# Altium schematic sheet SoC_FPGA_128-131_GTY.SchDoc: RFSoC AMC
size 420 x 297 mm; CompanyName: WUT; DrawnBy: T. Przywozki; Organization: WUT ISE; Address1: Warsaw University of Technology; Address2: Nowowiejska 15/19 00-665 Warsaw; Address3: Tomasz.Przywozki@pw.edu.pl; DocumentNumber: 6; Revision: 1; SheetNumber: 6; SheetTotal: 45; Project: RFSoC AMC; ModifiedBy: T. Przywozki; CreateDate: -; CheckedDate: -; DivGrp: ISE; Designer: T. Przywozki; ModifiedDate: -; ProjectName: ADC/DAC MEZZANINE
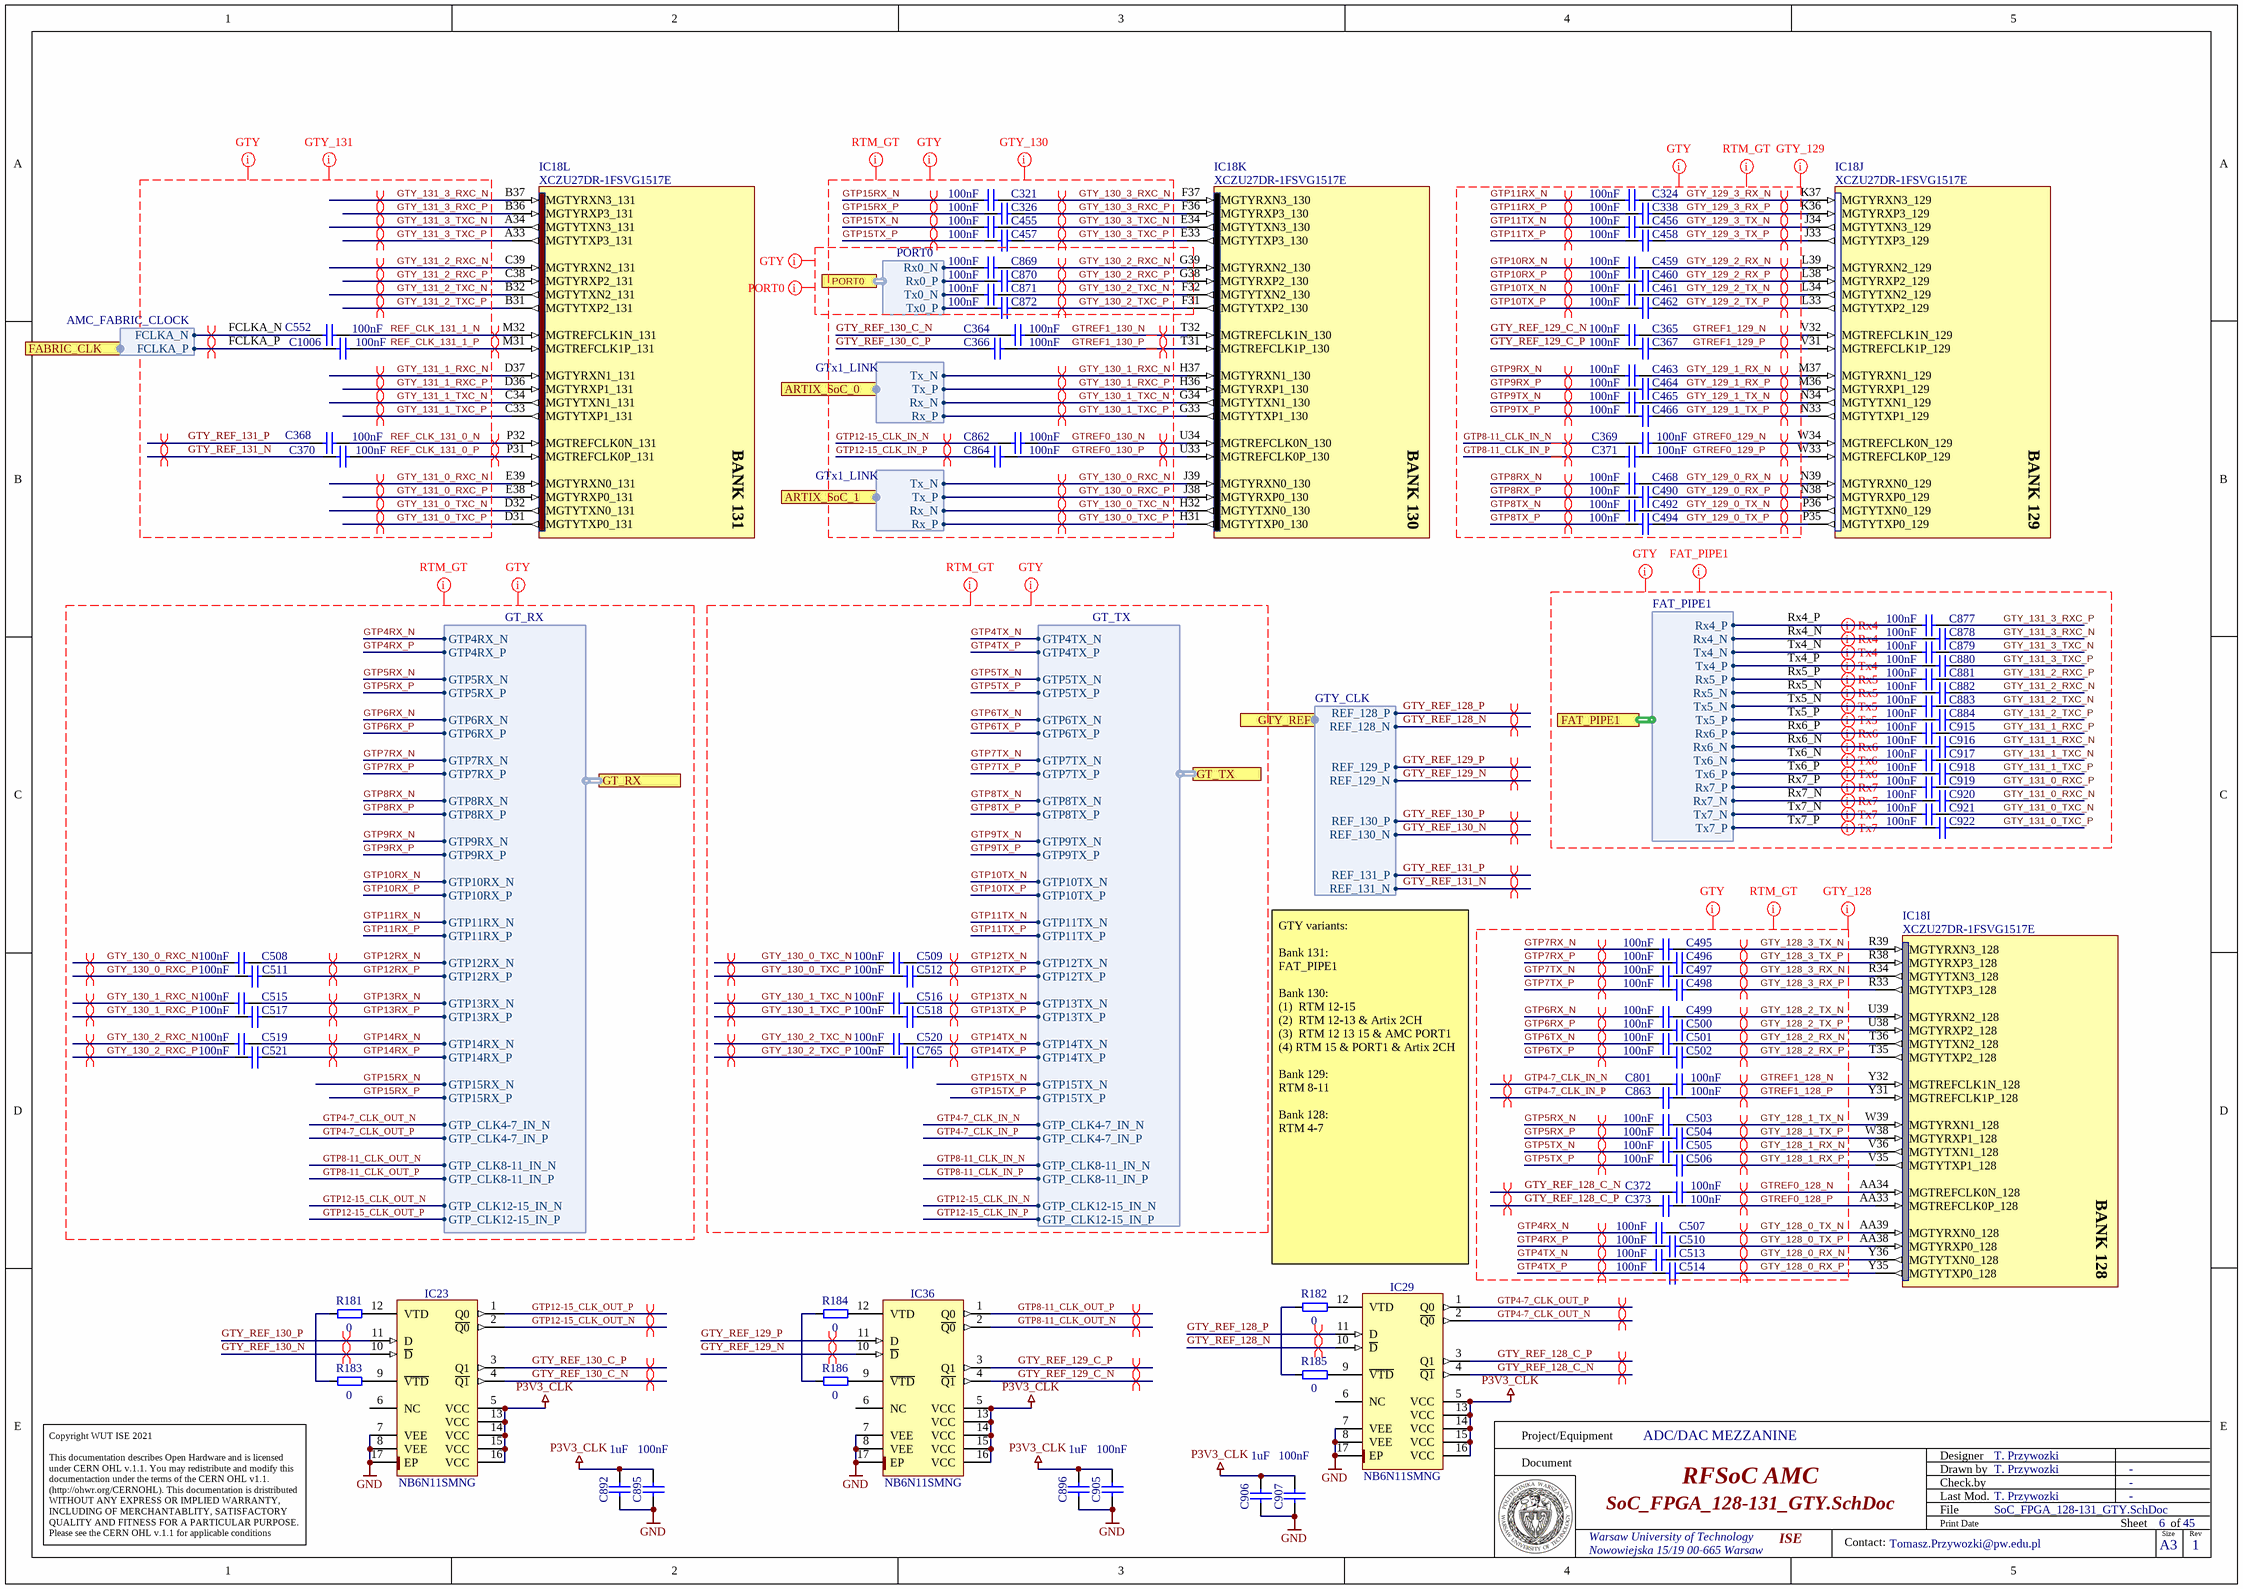
[diagram p0: SoC_FPGA_128-131_GTY.SchDoc]

## Parts
C321  100nF  [CAPC0603X33N]
C324  100nF  [CAPC0603X33N]
C326  100nF  [CAPC0603X33N]
C338  100nF  [CAPC0603X33N]
C364  100nF  [CAPC0603X33N]
C365  100nF  [CAPC0603X33N]
C366  100nF  [CAPC0603X33N]
C367  100nF  [CAPC0603X33N]
C368  100nF  [CAPC0603X33N]
C369  100nF  [CAPC0603X33N]
C370  100nF  [CAPC0603X33N]
C371  100nF  [CAPC0603X33N]
C372  100nF  [CAPC0603X33N]
C373  100nF  [CAPC0603X33N]
C455  100nF  [CAPC0603X33N]
C456  100nF  [CAPC0603X33N]
C457  100nF  [CAPC0603X33N]
C458  100nF  [CAPC0603X33N]
C459  100nF  [CAPC0603X33N]
C460  100nF  [CAPC0603X33N]
C461  100nF  [CAPC0603X33N]
C462  100nF  [CAPC0603X33N]
C463  100nF  [CAPC0603X33N]
C464  100nF  [CAPC0603X33N]
C465  100nF  [CAPC0603X33N]
C466  100nF  [CAPC0603X33N]
C468  100nF  [CAPC0603X33N]
C490  100nF  [CAPC0603X33N]
C492  100nF  [CAPC0603X33N]
C494  100nF  [CAPC0603X33N]
C495  100nF  [CAPC0603X33N]
C496  100nF  [CAPC0603X33N]
C497  100nF  [CAPC0603X33N]
C498  100nF  [CAPC0603X33N]
C499  100nF  [CAPC0603X33N]
C500  100nF  [CAPC0603X33N]
C501  100nF  [CAPC0603X33N]
C502  100nF  [CAPC0603X33N]
C503  100nF  [CAPC0603X33N]
C504  100nF  [CAPC0603X33N]
C505  100nF  [CAPC0603X33N]
C506  100nF  [CAPC0603X33N]
C507  100nF  [CAPC0603X33N]
C508  100nF  [CAPC0603X33N]
C509  100nF  [CAPC0603X33N]
C510  100nF  [CAPC0603X33N]
C511  100nF  [CAPC0603X33N]
C512  100nF  [CAPC0603X33N]
C513  100nF  [CAPC0603X33N]
C514  100nF  [CAPC0603X33N]
C515  100nF  [CAPC0603X33N]
C516  100nF  [CAPC0603X33N]
C517  100nF  [CAPC0603X33N]
C518  100nF  [CAPC0603X33N]
C519  100nF  [CAPC0603X33N]
C520  100nF  [CAPC0603X33N]
C521  100nF  [CAPC0603X33N]
C552  100nF  [CAPC0603X33N]
C765  100nF  [CAPC0603X33N]
C801  100nF  [CAPC0603X33N]
C862  100nF  [CAPC0603X33N]
C863  100nF  [CAPC0603X33N]
C864  100nF  [CAPC0603X33N]
C869  100nF  [CAPC0603X33N]
C870  100nF  [CAPC0603X33N]
C871  100nF  [CAPC0603X33N]
C872  100nF  [CAPC0603X33N]
C877  100nF  [CAPC0603X33N]
C878  100nF  [CAPC0603X33N]
C879  100nF  [CAPC0603X33N]
C880  100nF  [CAPC0603X33N]
C881  100nF  [CAPC0603X33N]
C882  100nF  [CAPC0603X33N]
C883  100nF  [CAPC0603X33N]
C884  100nF  [CAPC0603X33N]
C892  1uF  [CAPC1005X55N]
C895  100nF  [CAPC0603X33N]
C896  1uF  [CAPC1005X55N]
C905  100nF  [CAPC0603X33N]
C906  1uF  [CAPC1005X55N]
C907  100nF  [CAPC0603X33N]
C915  100nF  [CAPC0603X33N]
C916  100nF  [CAPC0603X33N]
C917  100nF  [CAPC0603X33N]
C918  100nF  [CAPC0603X33N]
C919  100nF  [CAPC0603X33N]
C920  100nF  [CAPC0603X33N]
C921  100nF  [CAPC0603X33N]
C922  100nF  [CAPC0603X33N]
C1006  100nF  [CAPC0603X33N]
IC18  XCZU27DR-1FSVG1517E  [XILINX_FSVG1517 (XCZU27DR)]  (parts I,J,K,L of 31)
IC23  NB6N11SMNG  [QFN50P300X300X100-17N-S185]
IC29  NB6N11SMNG  [QFN50P300X300X100-17N-S185]
IC36  NB6N11SMNG  [QFN50P300X300X100-17N-S185]
R181  0  [RESC1005X40N]
R182  0  [RESC1005X40N]
R183  0  [RESC1005X40N]
R184  0  [RESC1005X40N]
R185  0  [RESC1005X40N]
R186  0  [RESC1005X40N]

## Ports
ARTIX_SoC_0 (harness GTx1_LINK), ARTIX_SoC_1 (harness GTx1_LINK), FABRIC_CLK (harness AMC_FABRIC_CLOCK), FAT_PIPE1 (harness FAT_PIPE1), GT_RX (harness GT_RX), GT_TX (harness GT_TX), GTY_REF (harness GTY_CLK), PORT0 (harness PORT0)

## Harnesses
GT_RX: GTP5RX_N, GTP5RX_P, GTP6RX_N, GTP6RX_P, GTP7RX_N, GTP7RX_P, GTP8RX_N, GTP8RX_P, GTP9RX_N, GTP9RX_P, GTP10RX_N, GTP10RX_P, GTP11RX_N, GTP11RX_P, GTP12RX_N, GTP12RX_P, GTP13RX_N, GTP13RX_P, GTP14RX_N, GTP14RX_P, GTP15RX_N, GTP15RX_P, GTP4RX_N, GTP4RX_P, GTP_CLK4-7_IN_N, GTP_CLK8-11_IN_N, GTP_CLK4-7_IN_P, GTP_CLK8-11_IN_P, GTP_CLK12-15_IN_N, GTP_CLK12-15_IN_P
GT_TX: GTP5TX_N, GTP5TX_P, GTP6TX_N, GTP6TX_P, GTP7TX_N, GTP7TX_P, GTP8TX_N, GTP8TX_P, GTP9TX_N, GTP9TX_P, GTP10TX_N, GTP10TX_P, GTP11TX_N, GTP11TX_P, GTP12TX_N, GTP12TX_P, GTP13TX_N, GTP13TX_P, GTP14TX_N, GTP14TX_P, GTP15TX_N, GTP15TX_P, GTP4TX_N, GTP4TX_P, GTP_CLK4-7_IN_N, GTP_CLK8-11_IN_N, GTP_CLK4-7_IN_P, GTP_CLK8-11_IN_P, GTP_CLK12-15_IN_N, GTP_CLK12-15_IN_P
FAT_PIPE1: Rx4_P, Rx4_N, Tx4_N, Tx4_P, Rx5_P, Rx5_N, Tx5_N, Tx5_P, Rx6_P, Rx6_N, Tx6_N, Tx6_P, Rx7_P, Rx7_N, Tx7_N, Tx7_P
GTx1_LINK: Rx_P, Rx_N, Tx_P, Tx_N
PORT0: Rx0_P, Rx0_N, Tx0_N, Tx0_P
AMC_FABRIC_CLOCK: FCLKA_N, FCLKA_P
GTY_CLK: REF_128_P, REF_128_N, REF_129_P, REF_129_N, REF_130_P, REF_130_N, REF_131_P, REF_131_N

## Nets
GND: C892.2 C895.1 C896.2 C905.1 C906.2 C907.1 IC23.7(VEE) IC23.8(VEE) IC23.17(EP) IC29.7(VEE) IC29.8(VEE) IC29.17(EP) IC36.7(VEE) IC36.8(VEE) IC36.17(EP)
P3V3_CLK: C892.1 C895.2 C896.1 C905.2 C906.1 C907.2 IC23.5(VCC) IC23.13(VCC) IC23.14(VCC) IC23.15(VCC) IC23.16(VCC) IC29.5(VCC) IC29.13(VCC) IC29.14(VCC) IC29.15(VCC) IC29.16(VCC) IC36.5(VCC) IC36.13(VCC) IC36.14(VCC) IC36.15(VCC) IC36.16(VCC)
FCLKA_N: C552.1 ; port FABRIC_CLK.FCLKA_N
FCLKA_P: C1006.1 ; port FABRIC_CLK.FCLKA_P
GTP4-7_CLK_IN_N: C801.2 ; port GT_TX.GTP_CLK4-7_IN_N
GTP4-7_CLK_IN_P: C863.2 ; port GT_TX.GTP_CLK4-7_IN_P
GTP4-7_CLK_OUT_N: IC29.2(~{Q0}) ; port GT_RX.GTP_CLK4-7_IN_N
GTP4-7_CLK_OUT_P: IC29.1(Q0) ; port GT_RX.GTP_CLK4-7_IN_P
GTP4RX_N: C507.2 ; port GT_RX.GTP4RX_N
GTP4RX_P: C510.2 ; port GT_RX.GTP4RX_P
GTP4TX_N: C513.2 ; port GT_TX.GTP4TX_N
GTP4TX_P: C514.2 ; port GT_TX.GTP4TX_P
GTP5RX_N: C503.2 ; port GT_RX.GTP5RX_N
GTP5RX_P: C504.2 ; port GT_RX.GTP5RX_P
GTP5TX_N: C505.2 ; port GT_TX.GTP5TX_N
GTP5TX_P: C506.2 ; port GT_TX.GTP5TX_P
GTP6RX_N: C499.2 ; port GT_RX.GTP6RX_N
GTP6RX_P: C500.2 ; port GT_RX.GTP6RX_P
GTP6TX_N: C501.2 ; port GT_TX.GTP6TX_N
GTP6TX_P: C502.2 ; port GT_TX.GTP6TX_P
GTP7RX_N: C495.2 ; port GT_RX.GTP7RX_N
GTP7RX_P: C496.2 ; port GT_RX.GTP7RX_P
GTP7TX_N: C497.2 ; port GT_TX.GTP7TX_N
GTP7TX_P: C498.2 ; port GT_TX.GTP7TX_P
GTP8-11_CLK_IN_N: C369.2 ; port GT_TX.GTP_CLK8-11_IN_N
GTP8-11_CLK_IN_P: C371.2 ; port GT_TX.GTP_CLK8-11_IN_P
GTP8-11_CLK_OUT_N: IC36.2(~{Q0}) ; port GT_RX.GTP_CLK8-11_IN_N
GTP8-11_CLK_OUT_P: IC36.1(Q0) ; port GT_RX.GTP_CLK8-11_IN_P
GTP8RX_N: C468.2 ; port GT_RX.GTP8RX_N
GTP8RX_P: C490.2 ; port GT_RX.GTP8RX_P
GTP8TX_N: C492.2 ; port GT_TX.GTP8TX_N
GTP8TX_P: C494.2 ; port GT_TX.GTP8TX_P
GTP9RX_N: C463.2 ; port GT_RX.GTP9RX_N
GTP9RX_P: C464.2 ; port GT_RX.GTP9RX_P
GTP9TX_N: C465.2 ; port GT_TX.GTP9TX_N
GTP9TX_P: C466.2 ; port GT_TX.GTP9TX_P
GTP10RX_N: C459.2 ; port GT_RX.GTP10RX_N
GTP10RX_P: C460.2 ; port GT_RX.GTP10RX_P
GTP10TX_N: C461.2 ; port GT_TX.GTP10TX_N
GTP10TX_P: C462.2 ; port GT_TX.GTP10TX_P
GTP11RX_N: C324.2 ; port GT_RX.GTP11RX_N
GTP11RX_P: C338.2 ; port GT_RX.GTP11RX_P
GTP11TX_N: C456.2 ; port GT_TX.GTP11TX_N
GTP11TX_P: C458.2 ; port GT_TX.GTP11TX_P
GTP12-15_CLK_IN_N: C862.2 ; port GT_TX.GTP_CLK12-15_IN_N
GTP12-15_CLK_IN_P: C864.2 ; port GT_TX.GTP_CLK12-15_IN_P
GTP12-15_CLK_OUT_N: IC23.2(~{Q0}) ; port GT_RX.GTP_CLK12-15_IN_N
GTP12-15_CLK_OUT_P: IC23.1(Q0) ; port GT_RX.GTP_CLK12-15_IN_P
GTP12RX_N: C508.1 ; port GT_RX.GTP12RX_N
GTP12RX_P: C511.1 ; port GT_RX.GTP12RX_P
GTP12TX_N: C509.1 ; port GT_TX.GTP12TX_N
GTP12TX_P: C512.1 ; port GT_TX.GTP12TX_P
GTP13RX_N: C515.1 ; port GT_RX.GTP13RX_N
GTP13RX_P: C517.1 ; port GT_RX.GTP13RX_P
GTP13TX_N: C516.1 ; port GT_TX.GTP13TX_N
GTP13TX_P: C518.1 ; port GT_TX.GTP13TX_P
GTP14RX_N: C519.1 ; port GT_RX.GTP14RX_N
GTP14RX_P: C521.1 ; port GT_RX.GTP14RX_P
GTP14TX_N: C520.1 ; port GT_TX.GTP14TX_N
GTP14TX_P: C765.1 ; port GT_TX.GTP14TX_P
GTP15RX_N: C321.2 ; port GT_RX.GTP15RX_N
GTP15RX_P: C326.2 ; port GT_RX.GTP15RX_P
GTP15TX_N: C455.2 ; port GT_TX.GTP15TX_N
GTP15TX_P: C457.2 ; port GT_TX.GTP15TX_P
GTREF0_128_N: C372.1 IC18.AA34(MGTREFCLK0N_128)
GTREF0_128_P: C373.1 IC18.AA33(MGTREFCLK0P_128)
GTREF0_129_N: C369.1 IC18.W34(MGTREFCLK0N_129)
GTREF0_129_P: C371.1 IC18.W33(MGTREFCLK0P_129)
GTREF0_130_N: C862.1 IC18.U34(MGTREFCLK0N_130)
GTREF0_130_P: C864.1 IC18.U33(MGTREFCLK0P_130)
GTREF1_128_N: C801.1 IC18.Y32(MGTREFCLK1N_128)
GTREF1_128_P: C863.1 IC18.Y31(MGTREFCLK1P_128)
GTREF1_129_N: C365.1 IC18.V32(MGTREFCLK1N_129)
GTREF1_129_P: C367.1 IC18.V31(MGTREFCLK1P_129)
GTREF1_130_N: C364.1 IC18.T32(MGTREFCLK1N_130)
GTREF1_130_P: C366.1 IC18.T31(MGTREFCLK1P_130)
GTY_128_0_RX_N: C513.1 IC18.Y36(MGTYTXN0_128)
GTY_128_0_RX_P: C514.1 IC18.Y35(MGTYTXP0_128)
GTY_128_0_TX_N: C507.1 IC18.AA39(MGTYRXN0_128)
GTY_128_0_TX_P: C510.1 IC18.AA38(MGTYRXP0_128)
GTY_128_1_RX_N: C505.1 IC18.V36(MGTYTXN1_128)
GTY_128_1_RX_P: C506.1 IC18.V35(MGTYTXP1_128)
GTY_128_1_TX_N: C503.1 IC18.W39(MGTYRXN1_128)
GTY_128_1_TX_P: C504.1 IC18.W38(MGTYRXP1_128)
GTY_128_2_RX_N: C501.1 IC18.T36(MGTYTXN2_128)
GTY_128_2_RX_P: C502.1 IC18.T35(MGTYTXP2_128)
GTY_128_2_TX_N: C499.1 IC18.U39(MGTYRXN2_128)
GTY_128_2_TX_P: C500.1 IC18.U38(MGTYRXP2_128)
GTY_128_3_RX_N: C497.1 IC18.R34(MGTYTXN3_128)
GTY_128_3_RX_P: C498.1 IC18.R33(MGTYTXP3_128)
GTY_128_3_TX_N: C495.1 IC18.R39(MGTYRXN3_128)
GTY_128_3_TX_P: C496.1 IC18.R38(MGTYRXP3_128)
GTY_129_0_RX_N: C468.1 IC18.N39(MGTYRXN0_129)
GTY_129_0_RX_P: C490.1 IC18.N38(MGTYRXP0_129)
GTY_129_0_TX_N: C492.1 IC18.P36(MGTYTXN0_129)
GTY_129_0_TX_P: C494.1 IC18.P35(MGTYTXP0_129)
GTY_129_1_RX_N: C463.1 IC18.M37(MGTYRXN1_129)
GTY_129_1_RX_P: C464.1 IC18.M36(MGTYRXP1_129)
GTY_129_1_TX_N: C465.1 IC18.N34(MGTYTXN1_129)
GTY_129_1_TX_P: C466.1 IC18.N33(MGTYTXP1_129)
GTY_129_2_RX_N: C459.1 IC18.L39(MGTYRXN2_129)
GTY_129_2_RX_P: C460.1 IC18.L38(MGTYRXP2_129)
GTY_129_2_TX_N: C461.1 IC18.L34(MGTYTXN2_129)
GTY_129_2_TX_P: C462.1 IC18.L33(MGTYTXP2_129)
GTY_129_3_RX_N: C324.1 IC18.K37(MGTYRXN3_129)
GTY_129_3_RX_P: C338.1 IC18.K36(MGTYRXP3_129)
GTY_129_3_TX_N: C456.1 IC18.J34(MGTYTXN3_129)
GTY_129_3_TX_P: C458.1 IC18.J33(MGTYTXP3_129)
GTY_130_0_RXC_N: C508.2 IC18.J39(MGTYRXN0_130) ; port ARTIX_SoC_1.Tx_N
GTY_130_0_RXC_P: C511.2 IC18.J38(MGTYRXP0_130) ; port ARTIX_SoC_1.Tx_P
GTY_130_0_TXC_N: C509.2 IC18.H32(MGTYTXN0_130) ; port ARTIX_SoC_1.Rx_N
GTY_130_0_TXC_P: C512.2 IC18.H31(MGTYTXP0_130) ; port ARTIX_SoC_1.Rx_P
GTY_130_1_RXC_N: C515.2 IC18.H37(MGTYRXN1_130) ; port ARTIX_SoC_0.Tx_N
GTY_130_1_RXC_P: C517.2 IC18.H36(MGTYRXP1_130) ; port ARTIX_SoC_0.Tx_P
GTY_130_1_TXC_N: C516.2 IC18.G34(MGTYTXN1_130) ; port ARTIX_SoC_0.Rx_N
GTY_130_1_TXC_P: C518.2 IC18.G33(MGTYTXP1_130) ; port ARTIX_SoC_0.Rx_P
GTY_130_2_RXC_N: C519.2 C869.1 IC18.G39(MGTYRXN2_130)
GTY_130_2_RXC_P: C521.2 C870.1 IC18.G38(MGTYRXP2_130)
GTY_130_2_TXC_N: C520.2 C871.1 IC18.F32(MGTYTXN2_130)
GTY_130_2_TXC_P: C765.2 C872.1 IC18.F31(MGTYTXP2_130)
GTY_130_3_RXC_N: C321.1 IC18.F37(MGTYRXN3_130)
GTY_130_3_RXC_P: C326.1 IC18.F36(MGTYRXP3_130)
GTY_130_3_TXC_N: C455.1 IC18.E34(MGTYTXN3_130)
GTY_130_3_TXC_P: C457.1 IC18.E33(MGTYTXP3_130)
GTY_131_0_RXC_N: C920.1 IC18.E39(MGTYRXN0_131)
GTY_131_0_RXC_P: C919.1 IC18.E38(MGTYRXP0_131)
GTY_131_0_TXC_N: C921.1 IC18.D32(MGTYTXN0_131)
GTY_131_0_TXC_P: C922.1 IC18.D31(MGTYTXP0_131)
GTY_131_1_RXC_N: C916.1 IC18.D37(MGTYRXN1_131)
GTY_131_1_RXC_P: C915.1 IC18.D36(MGTYRXP1_131)
GTY_131_1_TXC_N: C917.1 IC18.C34(MGTYTXN1_131)
GTY_131_1_TXC_P: C918.1 IC18.C33(MGTYTXP1_131)
GTY_131_2_RXC_N: C882.1 IC18.C39(MGTYRXN2_131)
GTY_131_2_RXC_P: C881.1 IC18.C38(MGTYRXP2_131)
GTY_131_2_TXC_N: C883.1 IC18.B32(MGTYTXN2_131)
GTY_131_2_TXC_P: C884.1 IC18.B31(MGTYTXP2_131)
GTY_131_3_RXC_N: C878.1 IC18.B37(MGTYRXN3_131)
GTY_131_3_RXC_P: C877.1 IC18.B36(MGTYRXP3_131)
GTY_131_3_TXC_N: C879.1 IC18.A34(MGTYTXN3_131)
GTY_131_3_TXC_P: C880.1 IC18.A33(MGTYTXP3_131)
GTY_REF_128_C_N: C372.2 IC29.4(~{Q1})
GTY_REF_128_C_P: C373.2 IC29.3(Q1)
GTY_REF_128_N: IC29.10(~{D}) ; port GTY_REF.REF_128_N
GTY_REF_128_P: IC29.11(D) ; port GTY_REF.REF_128_P
GTY_REF_129_C_N: C365.2 IC36.4(~{Q1})
GTY_REF_129_C_P: C367.2 IC36.3(Q1)
GTY_REF_129_N: IC36.10(~{D}) ; port GTY_REF.REF_129_N
GTY_REF_129_P: IC36.11(D) ; port GTY_REF.REF_129_P
GTY_REF_130_C_N: C364.2 IC23.4(~{Q1})
GTY_REF_130_C_P: C366.2 IC23.3(Q1)
GTY_REF_130_N: IC23.10(~{D}) ; port GTY_REF.REF_130_N
GTY_REF_130_P: IC23.11(D) ; port GTY_REF.REF_130_P
GTY_REF_131_N: C370.1 ; port GTY_REF.REF_131_N
GTY_REF_131_P: C368.1 ; port GTY_REF.REF_131_P
REF_CLK_131_0_N: C368.2 IC18.P32(MGTREFCLK0N_131)
REF_CLK_131_0_P: C370.2 IC18.P31(MGTREFCLK0P_131)
REF_CLK_131_1_N: C552.2 IC18.M32(MGTREFCLK1N_131)
REF_CLK_131_1_P: C1006.2 IC18.M31(MGTREFCLK1P_131)
Rx4_N: C878.2 ; port FAT_PIPE1.Rx4_N
Rx4_P: C877.2 ; port FAT_PIPE1.Rx4_P
Rx5_N: C882.2 ; port FAT_PIPE1.Rx5_N
Rx5_P: C881.2 ; port FAT_PIPE1.Rx5_P
Rx6_N: C916.2 ; port FAT_PIPE1.Rx6_N
Rx6_P: C915.2 ; port FAT_PIPE1.Rx6_P
Rx7_N: C920.2 ; port FAT_PIPE1.Rx7_N
Rx7_P: C919.2 ; port FAT_PIPE1.Rx7_P
Tx4_N: C879.2 ; port FAT_PIPE1.Tx4_N
Tx4_P: C880.2 ; port FAT_PIPE1.Tx4_P
Tx5_N: C883.2 ; port FAT_PIPE1.Tx5_N
Tx5_P: C884.2 ; port FAT_PIPE1.Tx5_P
Tx6_N: C917.2 ; port FAT_PIPE1.Tx6_N
Tx6_P: C918.2 ; port FAT_PIPE1.Tx6_P
Tx7_N: C921.2 ; port FAT_PIPE1.Tx7_N
Tx7_P: C922.2 ; port FAT_PIPE1.Tx7_P
NetC869_2: C869.2 ; port PORT0.Rx0_N
NetC870_2: C870.2 ; port PORT0.Rx0_P
NetC871_2: C871.2 ; port PORT0.Tx0_N
NetC872_2: C872.2 ; port PORT0.Tx0_P
NetIC23_9: IC23.9(~{VTD}) R183.2
NetIC23_12: IC23.12(VTD) R181.2
NetIC29_9: IC29.9(~{VTD}) R185.2
NetIC29_12: IC29.12(VTD) R182.2
NetIC36_9: IC36.9(~{VTD}) R186.2
NetIC36_12: IC36.12(VTD) R184.2
NetR181_1: R181.1 R183.1
NetR182_1: R182.1 R185.1
NetR184_1: R184.1 R186.1

Not connected (* = marked no-connect by the designer): IC23 6(NC); IC29 6(NC); IC36 6(NC)

## Layout directives
differential pair; differential pair class 100Ohm: GTP4-7_CLK_OUT_N, GTP4-7_CLK_OUT_P, GTP8-11_CLK_OUT_N, GTP8-11_CLK_OUT_P, GTP12-15_CLK_IN_N, GTP12-15_CLK_IN_P, GTP12-15_CLK_OUT_N, GTP12-15_CLK_OUT_P, GTP12RX_N, GTP12RX_P, GTP12TX_N, GTP12TX_P, GTP13RX_N, GTP13RX_P, GTP13TX_N, GTP13TX_P, GTP14RX_N, GTP14RX_P, GTP14TX_N, GTP14TX_P, GTP15RX_N, GTP15RX_P, GTP15TX_N, GTP15TX_P, GTREF0_129_N, GTREF0_129_P, GTREF1_129_N, GTREF1_129_P, GTY_129_0_RX_N, GTY_129_0_RX_P, GTY_129_0_TX_N, GTY_129_0_TX_P, GTY_129_1_RX_N, GTY_129_1_RX_P, GTY_129_1_TX_N, GTY_129_1_TX_P, GTY_129_2_RX_N, GTY_129_2_RX_P, GTY_129_2_TX_N, GTY_129_2_TX_P, GTY_129_3_RX_N, GTY_129_3_RX_P, GTY_129_3_TX_N, GTY_129_3_TX_P, GTY_130_0_RXC_N, GTY_130_0_RXC_P, GTY_130_0_TXC_N, GTY_130_0_TXC_P, GTY_130_1_RXC_N, GTY_130_1_RXC_P, GTY_130_1_TXC_N, GTY_130_1_TXC_P, GTY_130_2_RXC_N, GTY_130_2_RXC_P, GTY_130_2_TXC_N, GTY_130_2_TXC_P, GTY_130_3_RXC_N, GTY_130_3_RXC_P, GTY_130_3_TXC_N, GTY_130_3_TXC_P, GTY_131_0_RXC_N, GTY_131_0_RXC_P, GTY_131_0_TXC_N, GTY_131_0_TXC_P, GTY_131_1_RXC_N, GTY_131_1_RXC_P, GTY_131_1_TXC_N, GTY_131_1_TXC_P, GTY_131_2_RXC_N, GTY_131_2_RXC_P, GTY_131_2_TXC_N, GTY_131_2_TXC_P, GTY_131_3_RXC_P, GTY_131_3_TXC_N, GTY_131_3_TXC_P, GTY_REF_128_C_N, GTY_REF_128_C_P, GTY_REF_128_N, GTY_REF_128_P, GTY_REF_129_C_N, GTY_REF_129_C_P, GTY_REF_129_N, GTY_REF_129_P, GTY_REF_130_C_N, GTY_REF_130_C_P, GTY_REF_130_N, GTY_REF_130_P, GTY_REF_131_N, GTY_REF_131_P
differential pair: FCLKA_N, FCLKA_P, GTP4-7_CLK_IN_N, GTP4-7_CLK_IN_P, GTP4RX_N, GTP4RX_P, GTP4TX_N, GTP4TX_P, GTP5RX_N, GTP5RX_P, GTP5TX_N, GTP5TX_P, GTP6RX_N, GTP6RX_P, GTP6TX_N, GTP6TX_P, GTP7RX_N, GTP7RX_P, GTP7TX_N, GTP7TX_P, GTP8-11_CLK_IN_N, GTP8-11_CLK_IN_P, GTP8RX_N, GTP8RX_P, GTP8TX_N, GTP8TX_P, GTP9RX_N, GTP9RX_P, GTP9TX_N, GTP9TX_P, GTP10RX_N, GTP10RX_P, GTP10TX_N, GTP10TX_P, GTP11RX_N, GTP11RX_P, GTP11TX_N, GTP11TX_P, GTREF0_128_N, GTREF0_128_P, GTREF0_130_N, GTREF0_130_P, GTREF1_128_N, GTREF1_128_P, GTREF1_130_N, GTREF1_130_P, GTY_128_0_RX_N, GTY_128_0_RX_P, GTY_128_0_TX_N, GTY_128_0_TX_P, GTY_128_1_RX_N, GTY_128_1_RX_P, GTY_128_1_TX_N, GTY_128_1_TX_P, GTY_128_2_RX_N, GTY_128_2_RX_P, GTY_128_2_TX_N, GTY_128_2_TX_P, GTY_128_3_RX_N, GTY_128_3_RX_P, GTY_128_3_TX_N, GTY_128_3_TX_P, GTY_REF_128_C_N, GTY_REF_128_C_P, GTY_REF_128_N, GTY_REF_128_P, GTY_REF_129_N, GTY_REF_129_P, GTY_REF_130_N, GTY_REF_130_P, GTY_REF_131_N, GTY_REF_131_P, REF_CLK_131_0_N, REF_CLK_131_0_P, REF_CLK_131_1_N, REF_CLK_131_1_P, Rx4_N, Rx4_P, Rx5_N, Rx5_P, Rx6_N, Rx6_P, Rx7_N, Rx7_P, Tx4_N, Tx4_P, Tx5_N, Tx5_P, Tx6_N, Tx6_P, Tx7_N, Tx7_P
differential pair; differential pair class GTY: GTY_131_3_RXC_N
net class FAT_PIPE1: GTY_131_0_RXC_N, GTY_131_0_RXC_P, GTY_131_0_TXC_N, GTY_131_0_TXC_P, GTY_131_1_RXC_N, GTY_131_1_RXC_P, GTY_131_1_TXC_N, GTY_131_1_TXC_P, GTY_131_2_RXC_N, GTY_131_2_RXC_P, GTY_131_2_TXC_N, GTY_131_2_TXC_P, GTY_131_3_RXC_N, GTY_131_3_RXC_P, GTY_131_3_TXC_N, GTY_131_3_TXC_P, Rx4_N, Rx4_P, Rx5_N, Rx5_P, Rx6_N, Rx6_P, Rx7_N, Rx7_P, Tx4_N, Tx4_P, Tx5_N, Tx5_P, Tx6_N, Tx6_P, Tx7_N, Tx7_P
net class PORT0: GTY_130_2_RXC_N, GTY_130_2_RXC_P, GTY_130_2_TXC_N, GTY_130_2_TXC_P
net class GTY: GTY_130_2_RXC_N, GTY_130_2_RXC_P, GTY_130_2_TXC_N, GTY_130_2_TXC_P
net class GTY; net class GT: FCLKA_N, FCLKA_P, GTP4-7_CLK_IN_N, GTP4-7_CLK_IN_P, GTP4-7_CLK_OUT_N, GTP4-7_CLK_OUT_P, GTP4RX_N, GTP4RX_P, GTP4TX_N, GTP4TX_P, GTP5RX_N, GTP5RX_P, GTP5TX_N, GTP5TX_P, GTP6RX_N, GTP6RX_P, GTP6TX_N, GTP6TX_P, GTP7RX_N, GTP7RX_P, GTP7TX_N, GTP7TX_P, GTP8-11_CLK_IN_N, GTP8-11_CLK_IN_P, GTP8-11_CLK_OUT_N, GTP8-11_CLK_OUT_P, GTP8RX_N, GTP8RX_P, GTP8TX_N, GTP8TX_P, GTP9RX_N, GTP9RX_P, GTP9TX_N, GTP9TX_P, GTP10RX_N, GTP10RX_P, GTP10TX_N, GTP10TX_P, GTP11RX_N, GTP11RX_P, GTP11TX_N, GTP11TX_P, GTP12-15_CLK_IN_N, GTP12-15_CLK_IN_P, GTP12-15_CLK_OUT_N, GTP12-15_CLK_OUT_P, GTP12RX_N, GTP12RX_P, GTP12TX_N, GTP12TX_P, GTP13RX_N, GTP13RX_P, GTP13TX_N, GTP13TX_P, GTP14RX_N, GTP14RX_P, GTP14TX_N, GTP14TX_P, GTP15RX_N, GTP15RX_P, GTP15TX_N, GTP15TX_P, GTREF0_128_N, GTREF0_128_P, GTREF0_129_N, GTREF0_129_P, GTREF0_130_N, GTREF0_130_P, GTREF1_128_N, GTREF1_128_P, GTREF1_129_N, GTREF1_129_P, GTREF1_130_N, GTREF1_130_P, GTY_128_0_RX_N, GTY_128_0_RX_P, GTY_128_0_TX_N, GTY_128_0_TX_P, GTY_128_1_RX_N, GTY_128_1_RX_P, GTY_128_1_TX_N, GTY_128_1_TX_P, GTY_128_2_RX_N, GTY_128_2_RX_P, GTY_128_2_TX_N, GTY_128_2_TX_P, GTY_128_3_RX_N, GTY_128_3_RX_P, GTY_128_3_TX_N, GTY_128_3_TX_P, GTY_129_0_RX_N, GTY_129_0_RX_P, GTY_129_0_TX_N, GTY_129_0_TX_P, GTY_129_1_RX_N, GTY_129_1_RX_P, GTY_129_1_TX_N, GTY_129_1_TX_P, GTY_129_2_RX_N, GTY_129_2_RX_P, GTY_129_2_TX_N, GTY_129_2_TX_P, GTY_129_3_RX_N, GTY_129_3_RX_P, GTY_129_3_TX_N, GTY_129_3_TX_P, GTY_130_0_RXC_N, GTY_130_0_RXC_P, GTY_130_0_TXC_N, GTY_130_0_TXC_P, GTY_130_1_RXC_N, GTY_130_1_RXC_P, GTY_130_1_TXC_N, GTY_130_1_TXC_P, GTY_130_2_RXC_N, GTY_130_2_RXC_P, GTY_130_2_TXC_N, GTY_130_2_TXC_P, GTY_130_3_RXC_N, GTY_130_3_RXC_P, GTY_130_3_TXC_N, GTY_130_3_TXC_P, GTY_131_0_RXC_N, GTY_131_0_RXC_P, GTY_131_0_TXC_N, GTY_131_0_TXC_P, GTY_131_1_RXC_N, GTY_131_1_RXC_P, GTY_131_1_TXC_N, GTY_131_1_TXC_P, GTY_131_2_RXC_N, GTY_131_2_RXC_P, GTY_131_2_TXC_N, GTY_131_2_TXC_P, GTY_131_3_RXC_N, GTY_131_3_RXC_P, GTY_131_3_TXC_N, GTY_131_3_TXC_P, GTY_REF_128_C_N, GTY_REF_128_C_P, GTY_REF_129_C_N, GTY_REF_129_C_P, GTY_REF_130_C_N, GTY_REF_130_C_P, GTY_REF_131_N, GTY_REF_131_P, REF_CLK_131_0_N, REF_CLK_131_0_P, REF_CLK_131_1_N, REF_CLK_131_1_P, Rx4_N, Rx4_P, Rx5_N, Rx5_P, Rx6_N, Rx6_P, Rx7_N, Rx7_P, Tx4_N, Tx4_P, Tx5_N, Tx5_P, Tx6_N, Tx6_P, Tx7_N, Tx7_P
net class RTM_GT: GTP4-7_CLK_IN_N, GTP4-7_CLK_IN_P, GTP4-7_CLK_OUT_N, GTP4-7_CLK_OUT_P, GTP4RX_N, GTP4RX_P, GTP4TX_N, GTP4TX_P, GTP5RX_N, GTP5RX_P, GTP5TX_N, GTP5TX_P, GTP6RX_N, GTP6RX_P, GTP6TX_N, GTP6TX_P, GTP7RX_N, GTP7RX_P, GTP7TX_N, GTP7TX_P, GTP8-11_CLK_IN_N, GTP8-11_CLK_IN_P, GTP8-11_CLK_OUT_N, GTP8-11_CLK_OUT_P, GTP8RX_N, GTP8RX_P, GTP8TX_N, GTP8TX_P, GTP9RX_N, GTP9RX_P, GTP9TX_N, GTP9TX_P, GTP10RX_N, GTP10RX_P, GTP10TX_N, GTP10TX_P, GTP11RX_N, GTP11RX_P, GTP11TX_N, GTP11TX_P, GTP12-15_CLK_IN_N, GTP12-15_CLK_IN_P, GTP12-15_CLK_OUT_N, GTP12-15_CLK_OUT_P, GTP12RX_N, GTP12RX_P, GTP12TX_N, GTP12TX_P, GTP13RX_N, GTP13RX_P, GTP13TX_N, GTP13TX_P, GTP14RX_N, GTP14RX_P, GTP14TX_N, GTP14TX_P, GTP15RX_N, GTP15RX_P, GTP15TX_N, GTP15TX_P, GTREF0_128_N, GTREF0_128_P, GTREF0_129_N, GTREF0_129_P, GTREF0_130_N, GTREF0_130_P, GTREF1_128_N, GTREF1_128_P, GTREF1_129_N, GTREF1_129_P, GTREF1_130_N, GTREF1_130_P, GTY_128_0_RX_N, GTY_128_0_RX_P, GTY_128_0_TX_N, GTY_128_0_TX_P, GTY_128_1_RX_N, GTY_128_1_RX_P, GTY_128_1_TX_N, GTY_128_1_TX_P, GTY_128_2_RX_N, GTY_128_2_RX_P, GTY_128_2_TX_N, GTY_128_2_TX_P, GTY_128_3_RX_N, GTY_128_3_RX_P, GTY_128_3_TX_N, GTY_128_3_TX_P, GTY_129_0_RX_N, GTY_129_0_RX_P, GTY_129_0_TX_N, GTY_129_0_TX_P, GTY_129_1_RX_N, GTY_129_1_RX_P, GTY_129_1_TX_N, GTY_129_1_TX_P, GTY_129_2_RX_N, GTY_129_2_RX_P, GTY_129_2_TX_N, GTY_129_2_TX_P, GTY_129_3_RX_N, GTY_129_3_RX_P, GTY_129_3_TX_N, GTY_129_3_TX_P, GTY_130_0_RXC_N, GTY_130_0_RXC_P, GTY_130_0_TXC_N, GTY_130_0_TXC_P, GTY_130_1_RXC_N, GTY_130_1_RXC_P, GTY_130_1_TXC_N, GTY_130_1_TXC_P, GTY_130_2_RXC_N, GTY_130_2_RXC_P, GTY_130_2_TXC_N, GTY_130_2_TXC_P, GTY_130_3_RXC_N, GTY_130_3_RXC_P, GTY_130_3_TXC_N, GTY_130_3_TXC_P, GTY_REF_128_C_N, GTY_REF_128_C_P, GTY_REF_129_C_N, GTY_REF_129_C_P, GTY_REF_130_C_N, GTY_REF_130_C_P
net class GTY_131: FCLKA_N, FCLKA_P, GTY_131_0_RXC_N, GTY_131_0_RXC_P, GTY_131_0_TXC_N, GTY_131_0_TXC_P, GTY_131_1_RXC_N, GTY_131_1_RXC_P, GTY_131_1_TXC_N, GTY_131_1_TXC_P, GTY_131_2_RXC_N, GTY_131_2_RXC_P, GTY_131_2_TXC_N, GTY_131_2_TXC_P, GTY_131_3_RXC_N, GTY_131_3_RXC_P, GTY_131_3_TXC_N, GTY_131_3_TXC_P, GTY_REF_131_N, GTY_REF_131_P, REF_CLK_131_0_N, REF_CLK_131_0_P, REF_CLK_131_1_N, REF_CLK_131_1_P
net class GTY_130: GTP12-15_CLK_IN_N, GTP12-15_CLK_IN_P, GTP15RX_N, GTP15RX_P, GTP15TX_N, GTP15TX_P, GTREF0_130_N, GTREF0_130_P, GTREF1_130_N, GTREF1_130_P, GTY_130_0_RXC_N, GTY_130_0_RXC_P, GTY_130_0_TXC_N, GTY_130_0_TXC_P, GTY_130_1_RXC_N, GTY_130_1_RXC_P, GTY_130_1_TXC_N, GTY_130_1_TXC_P, GTY_130_2_RXC_N, GTY_130_2_RXC_P, GTY_130_2_TXC_N, GTY_130_2_TXC_P, GTY_130_3_RXC_N, GTY_130_3_RXC_P, GTY_130_3_TXC_N, GTY_130_3_TXC_P, GTY_REF_130_C_N, GTY_REF_130_C_P
net class GTY_129: GTP8-11_CLK_IN_N, GTP8-11_CLK_IN_P, GTP8RX_N, GTP8RX_P, GTP8TX_N, GTP8TX_P, GTP9RX_N, GTP9RX_P, GTP9TX_N, GTP9TX_P, GTP10RX_N, GTP10RX_P, GTP10TX_N, GTP10TX_P, GTP11RX_N, GTP11RX_P, GTP11TX_N, GTP11TX_P, GTREF0_129_N, GTREF0_129_P, GTREF1_129_N, GTREF1_129_P, GTY_129_0_RX_N, GTY_129_0_RX_P, GTY_129_0_TX_N, GTY_129_0_TX_P, GTY_129_1_RX_N, GTY_129_1_RX_P, GTY_129_1_TX_N, GTY_129_1_TX_P, GTY_129_2_RX_N, GTY_129_2_RX_P, GTY_129_2_TX_N, GTY_129_2_TX_P, GTY_129_3_RX_N, GTY_129_3_RX_P, GTY_129_3_TX_N, GTY_129_3_TX_P, GTY_REF_129_C_N, GTY_REF_129_C_P
net class GTY_128: GTP4-7_CLK_IN_N, GTP4-7_CLK_IN_P, GTP4RX_N, GTP4RX_P, GTP4TX_N, GTP4TX_P, GTP5RX_N, GTP5RX_P, GTP5TX_N, GTP5TX_P, GTP6RX_N, GTP6RX_P, GTP6TX_N, GTP6TX_P, GTP7RX_N, GTP7RX_P, GTP7TX_N, GTP7TX_P, GTREF0_128_N, GTREF0_128_P, GTREF1_128_N, GTREF1_128_P, GTY_128_0_RX_N, GTY_128_0_RX_P, GTY_128_0_TX_N, GTY_128_0_TX_P, GTY_128_1_RX_N, GTY_128_1_RX_P, GTY_128_1_TX_N, GTY_128_1_TX_P, GTY_128_2_RX_N, GTY_128_2_RX_P, GTY_128_2_TX_N, GTY_128_2_TX_P, GTY_128_3_RX_N, GTY_128_3_RX_P, GTY_128_3_TX_N, GTY_128_3_TX_P, GTY_REF_128_C_N, GTY_REF_128_C_P

## Notes on the sheet
- GTY variants:
  Bank 131:
  FAT_PIPE1
  Bank 130:
  (1)  RTM 12-15
  (2)  RTM 12-13 & Artix 2CH
  (3)  RTM 12 13 15 & AMC PORT1
  (4) RTM 15 & PORT1 & Artix 2CH
  Bank 129:
  RTM 8-11
  Bank 128:
  RTM 4-7
- Project/Equipment
- Document
- Designer
- Drawn by
- Check.by
- Copyright WUT ISE 2021
  This documentation describes Open Hardware and is licensed under CERN OHL v.1.1. You may redistribute and modify this documentaction under the terms of the CERN OHL v1.1.
  (http://ohwr.org/CERNOHL). This documentation is dristributed WITHOUT ANY EXPRESS OR IMPLIED WARRANTY, INCLUDING OF MERCHANTABLITY, SATISFACTORY QUALITY AND FITNESS FOR A PARTICULAR PURPOSE. Please see the CERN OHL v.1.1 for applicable conditions
- File
- Last Mod.
- Print Date
- Sheet
- Size
- A3
- of
- Rev
- Contact:
- (in symbol XCZU27DR-1FSVG1517E, part I) BANK 128
- (in symbol XCZU27DR-1FSVG1517E, part J) BANK 129
- (in symbol XCZU27DR-1FSVG1517E, part K) BANK 130
- (in symbol XCZU27DR-1FSVG1517E, part L) BANK 131

## Library data of the parts
C321 C324 C326 C338 C365 C367 C368 C370 C455-C466 C468 C490 C492 C494-C521 C552 C765 C869-C872 C877-C884 C895 C905 C907 C915-C922 C1006 = CC0201_100NF_6.3V_10%_X5R: Non-polarised capacitor; Manufacturer: GENERIC; Part Description: SMD Multilayer Chip Ceramic Capacitor; Manufacturer1 Part Number: 02016D104KAT2A; Tolerance: ±10%; Voltage: 6.3V; TC: X5R; Manufacturer Part Number: CC0201_100NF_6.3V_10%_X5R; Part Number: CC0201_100NF_6.3V_10%_X5R; Value: 100nF; Component Kind: Standard; Component Type: Standard; Pin Count: 2; Status: Not Recommended; Case: 0201; Mounted: Yes; Socket: No; SMD: Yes; Sense: No; Manufacturer1 Example: AVX; Manufacturer1 ComponentHeight: 0.33mm; HelpURL: \\cern.ch\dfs\Applications\Altium\Datasheets\CC0201_X5R_AVX.pdf; Author: CERN DEM JLC
  C321 C324 C326 C338 C365 C367 C455-C466 C468 C490 C492 C494-C521 C765 C869-C872 C877-C884 C895 C905 C907 C915-C922: CreateDate: 03.12.2007; LatestRevisionDate: 03.12.2007
  C368 C370 C552 C1006: CreateDate: 03/12/2007; LatestRevisionDate: 03/12/2007
C364 C366 C369 C371-C373 C801 C862-C864 = CC0201_100NF_6.3V_10%_X5R: Non-polarised capacitor; Part Description: SMD Multilayer Chip Ceramic Capacitor; Manufacturer: GENERIC; Manufacturer1 Part Number: 02016D104KAT2A; Voltage: 6.3V; TC: X5R; Tolerance: ±10%; Part Number: CC0201_100NF_6.3V_10%_X5R; Component Kind: Standard; Component Type: Standard; Pin Count: 2; Value: 100nF; Status: Not Recommended; Manufacturer Part Number: CC0201_100NF_6.3V_10%_X5R; Case: 0201; Mounted: Yes; Socket: No; SMD: Yes; Sense: No; Manufacturer1 Example: AVX; Manufacturer1 ComponentHeight: 0.33mm; HelpURL: \\cern.ch\dfs\Applications\Altium\Datasheets\CC0201_X5R_AVX.pdf; Author: CERN DEM JLC; CreateDate: 03/12/2007; LatestRevisionDate: 03/12/2007
C892 C896 C906 = CC0402_1UF_16V_10%_X5R: Non-polarised capacitor; Manufacturer: GENERIC; Part Description: SMD Multilayer Chip Ceramic Capacitor; Manufacturer1 Part Number: C1005X5R1C105KT; Tolerance: ±10%; Voltage: 16V; TC: X5R; Manufacturer Part Number: CC0402_1UF_16V_10%_X5R; Part Number: CC0402_1UF_16V_10%_X5R; Value: 1uF; Component Kind: Standard; Component Type: Standard; Pin Count: 2; Status: Preferred; Case: 0402; Mounted: Yes; Socket: No; SMD: Yes; Sense: No; Manufacturer1 Example: TDK; Manufacturer1 ComponentHeight: 0.55mm; HelpURL: \\cern.ch\dfs\Applications\Altium\Datasheets\CC0402_X5R_TDK_C.pdf; Author: CERN DEM JLC; CreateDate: 25.10.2012; LatestRevisionDate: 25.10.2012
IC18 = XCZU27DR-1FSVG1517E: Zynq UltraScale+ RFSoC, Quad-Core ARM® Cortex™-A53 MPCore™ up to 1.5GHz, 214 PS I/O, 299 HP I/O, 48 HD I/O, 1517-Pin BGA; Manufacturer: XILINX; PressFit: No; Bonding: No; Part Number: XCZU27DR-1FSVG1517E; Component Kind: Standard; Component Type: Standard; Device: XCZU27DR-1FSVG1517E; PackageDescription: BGA, 1.00mm Pitch, Square; 1517 Pin, 39 Columns X 39 Rows, 40.00mm X 40.00mm X 4.01mm H; Part Description: Zynq UltraScale+ RFSoC, Quad-Core ARM® Cortex™-A53 MPCore™ up to 1.5GHz, 214 PS I/O, 299 HP I/O, 48 HD I/O, 1517-Pin BGA; Manufacturer Part Number: XCZU27DR-1FSVG1517E; Pin Count: 1517; Case: BGA1517; Mounted: Yes; Socket: No; SMD: Yes; Sense: No; ComponentHeight: 4.01mm; HelpURL: \\cern.ch\dfs\Applications\Altium\Datasheets\XCZU27DR-1FSVG1517E.pdf; ComponentLink1URL: \\cern.ch\dfs\Applications\Altium\Datasheets\XCZU27DR-1FSVG1517E_Package-Pinout.pdf; ComponentLink1Description: Package/Pinout; ComponentLink2URL: \\cern.ch\dfs\Applications\Altium\Datasheets\XCZU27DR-1FSVG1517E_Pinout.pdf; ComponentLink2Description: Pinout; Author: CERN DEM MR; CreateDate: 02/05/2018; LatestRevisionDate: 02/05/2018
IC23 IC29 IC36 = NB6N11SMNG: 3.3V 1:2 AnyLevel Input to LVDS Fanout Buffer / Translator; Manufacturer: ON SEMICONDUCTOR; PressFit: No; Bonding: No; Part Number: NB6N11SMNG; Component Kind: Standard; Component Type: Standard; Device: NB6N11SMNG; PackageDescription: QFN, 0.50mm Pitch, Square; 16 Pin, 3.00mm L X 3.00mm W X 1.00mm H body (w/Thermal Tab 1.85 X 1.85mm), IPC Medium Density; Part Description: 3.3V 1:2 AnyLevel Input to LVDS Fanout Buffer / Translator; Manufacturer Part Number: NB6N11SMNG; Pin Count: 17; Case: QFN16; Mounted: Yes; Socket: No; SMD: Yes; Sense: No; ComponentHeight: 1mm; Author: CERN DEM JLC; HelpURL: \\cern.ch\dfs\Applications\Altium\Datasheets\NB6N11SMNG.pdf; CreateDate: 14.05.2013; LatestRevisionDate: 14.05.2013
R181-R186 = R0402_0R_JUMPER: Resistor; Part Description: 1A (0.05R Max DC Resistance) Zero Ohm Jumper; Manufacturer: GENERIC; Manufacturer1 Part Number: 232270591001L; PressFit: No; Part Number: R0402_0R_JUMPER; Component Kind: Standard; Component Type: Standard; Pin Count: 2; Value: 0; Status: Not Recommended; Manufacturer Part Number: R0402_0R_JUMPER; Case: 0402; Mounted: Yes; Sense: No; Socket: No; SMD: Yes; Manufacturer1 Example: YAGEO PHYCOMP; Manufacturer1 ComponentHeight: 0.4mm; HelpURL: \\cern.ch\dfs\Applications\Altium\Datasheets\R0402_Phycomp_RC0402.pdf; Author: CERN DEM JLC; CreateDate: 03.12.2007; LatestRevisionDate: 17.10.2012